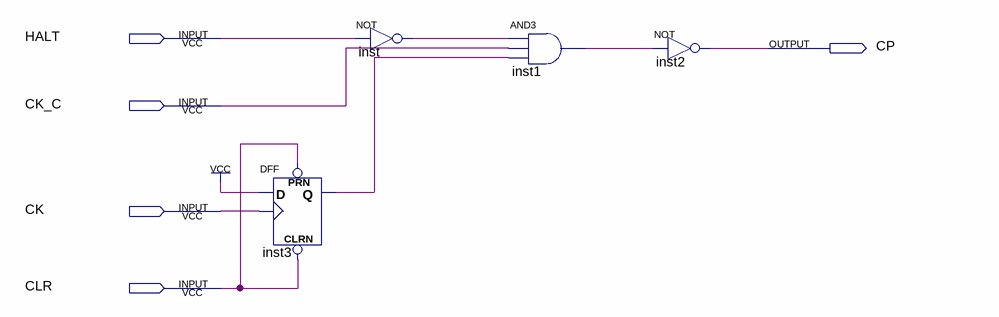
[diagram p0: schematic sheet]
// Quartus schematic start_circuit_2.bdf as structural Verilog: 4 symbols, 5 pins
module start_circuit_2 (
  input  HALT,
  input  CK_C,
  input  CK,
  input  CLR,
  output CP
);

  wire inst1_out, inst3_q, inst_out;

  DFF inst3 (.CLRN(CLR), .CLK(CK), .D(1'b1), .PRN(CLR), .Q(inst3_q));
  not inst (inst_out, HALT);
  and inst1 (inst1_out, inst_out, CK_C, inst3_q);
  not inst2 (CP, inst1_out);
endmodule
